# Altium schematic sheet STM32F103C8T6.SchDoc: STM32F103C8T6 CORE
size OrCAD A; Author: Geekchun; DocumentNumber: 1.0; Revision: 1.0; SheetNumber: 1; SheetTotal: 3
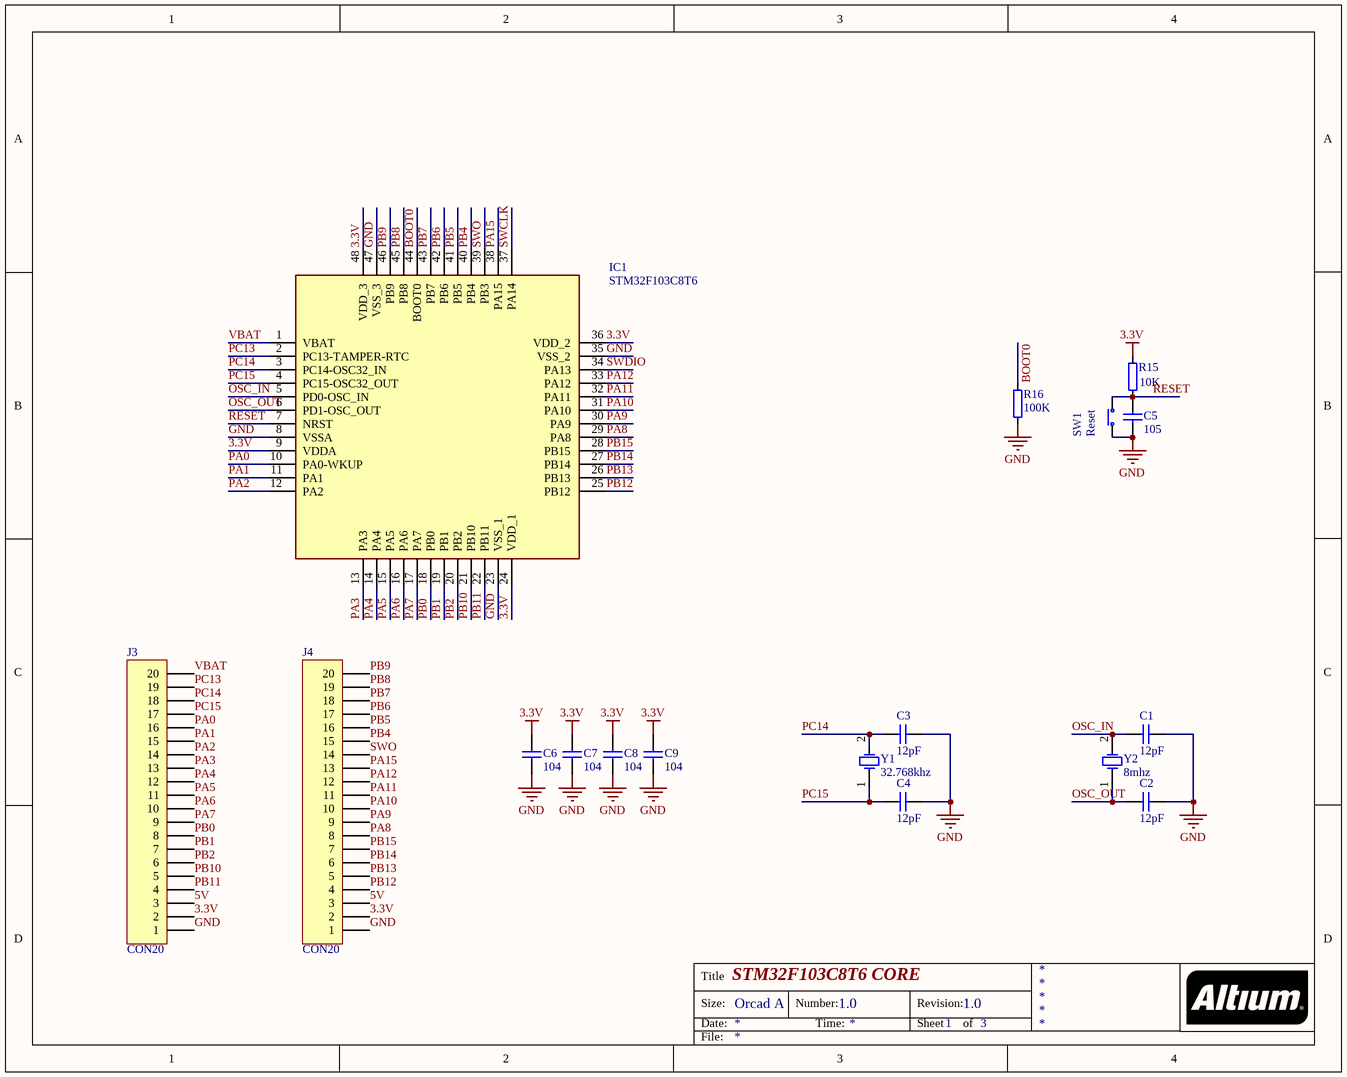
[diagram p0: STM32F103C8T6.SchDoc]

## Parts
C1  12pF  [C 0603_L]
C2  12pF  [C 0603_L]
C3  12pF  [C 0603_L]
C4  12pF  [C 0603_L]
C5  105  [C 0603_L]
C6  104  [C 0603_L]
C7  104  [C 0603_L]
C8  104  [C 0603_L]
C9  104  [C 0603_L]
IC1  STM32F103C8T6  [QFP50P900X900X160-48N]
J3  CON20  [HDR2.54-LI-20P]
J4  CON20  [HDR2.54-LI-20P]
R15  10K  [R 0603_L]
R16  100K  [R 0603_L]
SW1  Reset  [TSW SMD-6*6*5]
Y1  32.768khz  [OSC 3215-2P]
Y2  8mhz  [OSC 5032-2P]

## Nets
3.3V: C6.2 C7.2 C8.2 C9.2 IC1.9(VDDA) IC1.24(VDD_1) IC1.36(VDD_2) IC1.48(VDD_3) J3.2 J4.2 R15.2
GND: C1.2 C2.2 C3.2 C4.2 C5.1 C6.1 C7.1 C8.1 C9.1 IC1.8(VSSA) IC1.23(VSS_1) IC1.35(VSS_2) IC1.47(VSS_3) J3.1 J4.1 R16.2 SW1.2(COM)
5V: J3.3 J4.3
BOOT0: IC1.44(BOOT0) R16.1
OSC_IN: C1.1 IC1.5(PD0-OSC_IN) Y2.2
OSC_OUT: C2.1 IC1.6(PD1-OSC_OUT) Y2.1
PA0: IC1.10(PA0-WKUP) J3.16
PA1: IC1.11(PA1) J3.15
PA2: IC1.12(PA2) J3.14
PA3: IC1.13(PA3) J3.13
PA4: IC1.14(PA4) J3.12
PA5: IC1.15(PA5) J3.11
PA6: IC1.16(PA6) J3.10
PA7: IC1.17(PA7) J3.9
PA8: IC1.29(PA8) J4.8
PA9: IC1.30(PA9) J4.9
PA10: IC1.31(PA10) J4.10
PA11: IC1.32(PA11) J4.11
PA12: IC1.33(PA12) J4.12
PA15: IC1.38(PA15) J4.13
PB0: IC1.18(PB0) J3.8
PB1: IC1.19(PB1) J3.7
PB2: IC1.20(PB2) J3.6
PB4: IC1.40(PB4) J4.15
PB5: IC1.41(PB5) J4.16
PB6: IC1.42(PB6) J4.17
PB7: IC1.43(PB7) J4.18
PB8: IC1.45(PB8) J4.19
PB9: IC1.46(PB9) J4.20
PB10: IC1.21(PB10) J3.5
PB11: IC1.22(PB11) J3.4
PB12: IC1.25(PB12) J4.4
PB13: IC1.26(PB13) J4.5
PB14: IC1.27(PB14) J4.6
PB15: IC1.28(PB15) J4.7
PC13: IC1.2(PC13-TAMPER-RTC) J3.19
PC14: C3.1 IC1.3(PC14-OSC32_IN) J3.18 Y1.2
PC15: C4.1 IC1.4(PC15-OSC32_OUT) J3.17 Y1.1
RESET: C5.2 IC1.7(NRST) R15.1 SW1.1(N.O)
SWCLK: IC1.37(PA14)
SWDIO: IC1.34(PA13)
SWO: IC1.39(PB3) J4.14
VBAT: IC1.1(VBAT) J3.20

## Notes on the sheet
- Title
- Size:
- Date:
- Orcad A
- Number:
- Time:
- Revision:
- Sheet
- of
- File:

## Library data of the parts
C1-C9 = CAP: Capacitor, NP0, ?.1pF; Part Number: C0402-1.2p; Value: 1.2pF; Note: 50V; Artikkelnr Noca: 20029157; Artikkelnr Simpro: N.A.; Manufacturer: *; Manufacturer Part Number: *; Datasheet: *; LatestRevisionDate: 2011-05-11; Pin Count: 2; Publisher: Nordic Semiconductor; Published: 2009-05-08; Supplier: *; Supplier part number: *; 2nd source Supplier: *; 2nd source part number: *; Footprint Doc: 0402
IC1 = STM32F103C8T6: Integrated Circuit; Manufacturer_Name: STMicroelectronics; Datasheet Link: http://www.st.com/st-web-ui/static/active/en/resource/technical/document/datasheet/CD00161566.pdf; Height: 1.6mm; Manufacturer_Part_Number: STM32F103C8T6; Arrow Part Number: STM32F103C8T6; Arrow Price/Stock: https://www.arrow.com/en/products/stm32f103c8t6/stmicroelectronics; Mouser Part Number: 511-STM32F103C8T6; Mouser Price/Stock: https://www.mouser.co.uk/ProductDetail/STMicroelectronics/STM32F103C8T6?qs=bhCVus9SdFtq6kqxsU5%2FDA%3D%3D
J3 J4 = CON20: Connector
R15 R16 = RES
SW1 = SW-PB: Tactile Switch, SPNO, SMD, 160gf, 6.2x6.3x2.5mm; Part Number: Switch-PB-6.2x6.3mm-SMD; Manufacturer: Dailywell; Manufacturer Part Number: TS604VM1-025BR-R; 2nd source part number: 688-SKHUALE010; Value: PB SW; Artikkelnr Noca: 50019106; Artikkelnr Simpro: N.A.; Datasheet: \\hizz\pro\app9717\Datasheet\switches\Daliywell\TS604VM1-025BR-R.pdf; Footprint Doc: Switch-PB-6.2x6.3mm-SMD; LatestRevisionDate: 2016-04-21; Pin Count: 4; Publisher: Nordic Semiconductor; Published: 2010-02-01; Note: *; Supplier: Cabcon; Supplier part number: TS604VM1-025BR-R; 2nd source Supplier: Mouser
Y1 Y2 = XTAL: XTAL: 12MHZ